# Altium schematic sheet Led Panel.SchDoc
size A; SheetNumber: 1; SheetTotal: 1
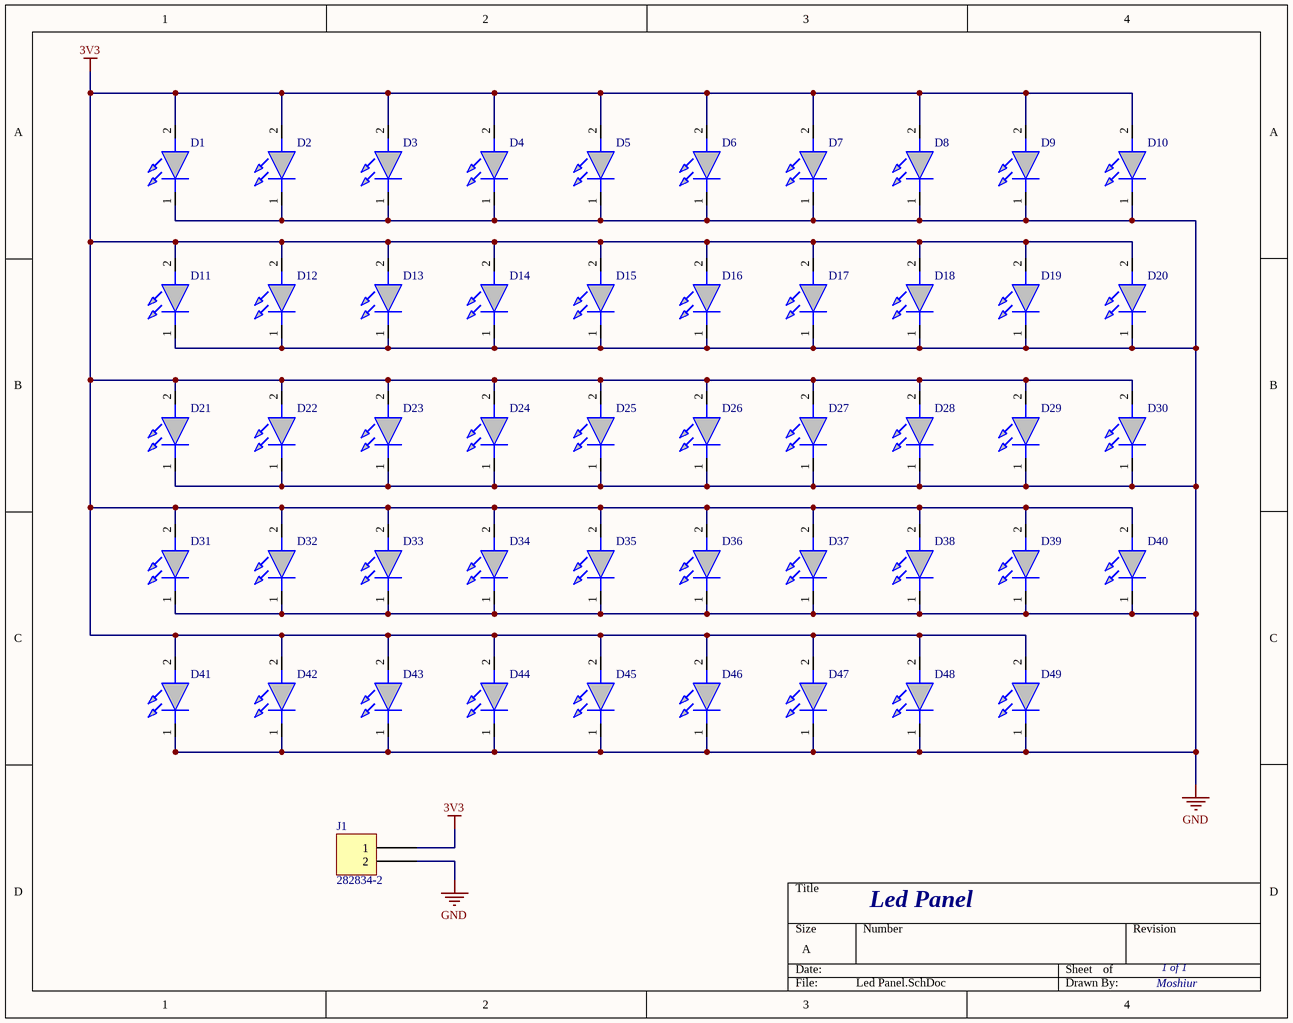
[diagram p0: Led Panel.SchDoc]

## Parts
D1  L1IG-0750100000000  [L1IG0750100000000]  (value not drawn)
D2  L1IG-0750100000000  [L1IG0750100000000]  (value not drawn)
D3  L1IG-0750100000000  [L1IG0750100000000]  (value not drawn)
D4  L1IG-0750100000000  [L1IG0750100000000]  (value not drawn)
D5  L1IG-0750100000000  [L1IG0750100000000]  (value not drawn)
D6  L1IG-0750100000000  [L1IG0750100000000]  (value not drawn)
D7  L1IG-0750100000000  [L1IG0750100000000]  (value not drawn)
D8  L1IG-0750100000000  [L1IG0750100000000]  (value not drawn)
D9  L1IG-0750100000000  [L1IG0750100000000]  (value not drawn)
D10  L1IG-0750100000000  [L1IG0750100000000]  (value not drawn)
D11  L1IG-0750100000000  [L1IG0750100000000]  (value not drawn)
D12  L1IG-0750100000000  [L1IG0750100000000]  (value not drawn)
D13  L1IG-0750100000000  [L1IG0750100000000]  (value not drawn)
D14  L1IG-0750100000000  [L1IG0750100000000]  (value not drawn)
D15  L1IG-0750100000000  [L1IG0750100000000]  (value not drawn)
D16  L1IG-0750100000000  [L1IG0750100000000]  (value not drawn)
D17  L1IG-0750100000000  [L1IG0750100000000]  (value not drawn)
D18  L1IG-0750100000000  [L1IG0750100000000]  (value not drawn)
D19  L1IG-0750100000000  [L1IG0750100000000]  (value not drawn)
D20  L1IG-0750100000000  [L1IG0750100000000]  (value not drawn)
D21  L1IG-0750100000000  [L1IG0750100000000]  (value not drawn)
D22  L1IG-0750100000000  [L1IG0750100000000]  (value not drawn)
D23  L1IG-0750100000000  [L1IG0750100000000]  (value not drawn)
D24  L1IG-0750100000000  [L1IG0750100000000]  (value not drawn)
D25  L1IG-0750100000000  [L1IG0750100000000]  (value not drawn)
D26  L1IG-0750100000000  [L1IG0750100000000]  (value not drawn)
D27  L1IG-0750100000000  [L1IG0750100000000]  (value not drawn)
D28  L1IG-0750100000000  [L1IG0750100000000]  (value not drawn)
D29  L1IG-0750100000000  [L1IG0750100000000]  (value not drawn)
D30  L1IG-0750100000000  [L1IG0750100000000]  (value not drawn)
D31  L1IG-0750100000000  [L1IG0750100000000]  (value not drawn)
D32  L1IG-0750100000000  [L1IG0750100000000]  (value not drawn)
D33  L1IG-0750100000000  [L1IG0750100000000]  (value not drawn)
D34  L1IG-0750100000000  [L1IG0750100000000]  (value not drawn)
D35  L1IG-0750100000000  [L1IG0750100000000]  (value not drawn)
D36  L1IG-0750100000000  [L1IG0750100000000]  (value not drawn)
D37  L1IG-0750100000000  [L1IG0750100000000]  (value not drawn)
D38  L1IG-0750100000000  [L1IG0750100000000]  (value not drawn)
D39  L1IG-0750100000000  [L1IG0750100000000]  (value not drawn)
D40  L1IG-0750100000000  [L1IG0750100000000]  (value not drawn)
D41  L1IG-0750100000000  [L1IG0750100000000]  (value not drawn)
D42  L1IG-0750100000000  [L1IG0750100000000]  (value not drawn)
D43  L1IG-0750100000000  [L1IG0750100000000]  (value not drawn)
D44  L1IG-0750100000000  [L1IG0750100000000]  (value not drawn)
D45  L1IG-0750100000000  [L1IG0750100000000]  (value not drawn)
D46  L1IG-0750100000000  [L1IG0750100000000]  (value not drawn)
D47  L1IG-0750100000000  [L1IG0750100000000]  (value not drawn)
D48  L1IG-0750100000000  [L1IG0750100000000]  (value not drawn)
D49  L1IG-0750100000000  [L1IG0750100000000]  (value not drawn)
J1  282834-2  [TE 282834-2]

## Nets
3V3: D1.2(A) D2.2(A) D3.2(A) D4.2(A) D5.2(A) D6.2(A) D7.2(A) D8.2(A) D9.2(A) D10.2(A) D11.2(A) D12.2(A) D13.2(A) D14.2(A) D15.2(A) D16.2(A) D17.2(A) D18.2(A) D19.2(A) D20.2(A) D21.2(A) D22.2(A) D23.2(A) D24.2(A) D25.2(A) D26.2(A) D27.2(A) D28.2(A) D29.2(A) D30.2(A) D31.2(A) D32.2(A) D33.2(A) D34.2(A) D35.2(A) D36.2(A) D37.2(A) D38.2(A) D39.2(A) D40.2(A) D41.2(A) D42.2(A) D43.2(A) D44.2(A) D45.2(A) D46.2(A) D47.2(A) D48.2(A) D49.2(A) J1.1
GND: D1.1(K) D2.1(K) D3.1(K) D4.1(K) D5.1(K) D6.1(K) D7.1(K) D8.1(K) D9.1(K) D10.1(K) D11.1(K) D12.1(K) D13.1(K) D14.1(K) D15.1(K) D16.1(K) D17.1(K) D18.1(K) D19.1(K) D20.1(K) D21.1(K) D22.1(K) D23.1(K) D24.1(K) D25.1(K) D26.1(K) D27.1(K) D28.1(K) D29.1(K) D30.1(K) D31.1(K) D32.1(K) D33.1(K) D34.1(K) D35.1(K) D36.1(K) D37.1(K) D38.1(K) D39.1(K) D40.1(K) D41.1(K) D42.1(K) D43.1(K) D44.1(K) D45.1(K) D46.1(K) D47.1(K) D48.1(K) D49.1(K) J1.2

## Notes on the sheet
- Led Panel
- 1 of 1
- Moshiur

## Library data of the parts
D1-D49 = L1IG-0750100000000: Infrared Emitters - High Power Broadrange IR LED 600 - 1050nm; Manufacturer_Name: Lumileds; Mouser Part Number: 997-L1IG075010000; Mouser Price/Stock: https://www.mouser.co.uk/ProductDetail/Lumileds/L1IG-0750100000000?qs=UXgszm6BlbFsaqyaTO4YIQ%3D%3D; Manufacturer_Part_Number: L1IG-0750100000000; Datasheet Link: https://www.lumileds.com/uploads/838/DS263-luxeon-ir-onyx-datasheet-pdf
J1 = 282834-2: TERM BLK 2P SIDE ENT 2.54MM PCB; Manufacturer: TE Connectivity AMP Connectors; Current: 10A; Mating Orientation: Horizontal with Board; Number of Levels: 1; Pitch: 0.100" (2.54mm); Positions Per Level: 2; Voltage: 150V; Wire Gauge: 16-30 AWG; Wire Termination: Screw - Rising Cage Clamp; Part Number: 282834-2; Color: Green; ComponentLink1Description: Datasheet; ComponentLink1URL: https://www.te.com/commerce/DocumentDelivery/DDEController?Action=srchrtrv&DocNm=282834&DocType=Customer+Drawing&DocLang=English; ComponentLink2Description: DigiKey Link; ComponentLink2URL: http://digikey.com/product-detail/en/te-connectivity-amp-connectors/282834-2/A98333-ND/1150135; LastUpdated: 1/15/2020 4:15:38 AM; Lifecycle Status: Active; Minimum Order: 1; Mounting Type: Through Hole; Packaging: Bulk; Part Status: Active; Price: 0.88; Series: Buchanan; Supplier 1: DigiKey; Supplier Part Number 1: A98333-ND